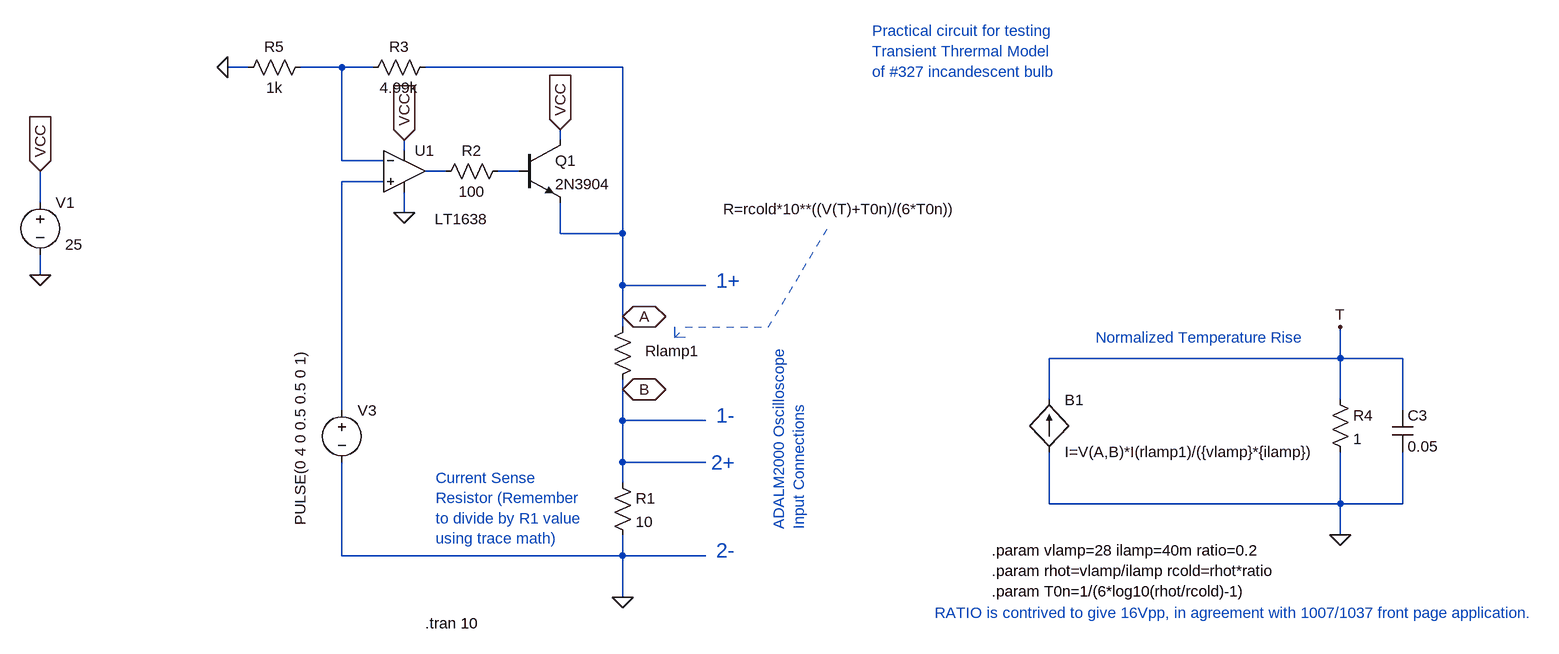
[diagram p0: schematic bulb_curve_tracer_circuit.asc]
bulb_curve_tracer_circuit.asc, the LTspice schematic file:
Version 4
SHEET 1 1952 844
WIRE -544 -304 -576 -304
WIRE -400 -304 -464 -304
WIRE -352 -304 -400 -304
WIRE 32 -304 -272 -304
WIRE -64 -192 -64 -208
WIRE -304 -176 -304 -192
WIRE -400 -160 -400 -304
WIRE -336 -160 -400 -160
WIRE -240 -144 -272 -144
WIRE -128 -144 -160 -144
WIRE -336 -128 -400 -128
WIRE -864 -96 -864 -144
WIRE -304 -80 -304 -112
WIRE -64 -48 -64 -96
WIRE 32 -48 32 -304
WIRE 32 -48 -64 -48
WIRE -864 16 -864 -16
WIRE 32 32 32 -48
WIRE 160 32 32 32
WIRE 32 80 32 32
WIRE 32 96 32 80
WIRE 1136 144 1136 96
WIRE 1136 144 688 144
WIRE 1232 144 1136 144
WIRE 32 192 32 176
WIRE 688 208 688 144
WIRE 1136 208 1136 144
WIRE -400 224 -400 -128
WIRE 1232 224 1232 144
WIRE 32 240 32 192
WIRE 160 240 32 240
WIRE 32 304 32 240
WIRE 160 304 32 304
WIRE 32 336 32 304
WIRE 688 368 688 288
WIRE 1136 368 1136 288
WIRE 1136 368 688 368
WIRE 1232 368 1232 288
WIRE 1232 368 1136 368
WIRE 1136 416 1136 368
WIRE -400 448 -400 304
WIRE 32 448 32 416
WIRE 32 448 -400 448
WIRE 160 448 32 448
WIRE 32 512 32 448
FLAG 32 512 0
FLAG 1136 96 T
FLAG 32 80 A
IOPIN 32 80 BiDir
FLAG 32 192 B
IOPIN 32 192 BiDir
FLAG 1136 416 0
FLAG -304 -80 0
FLAG -576 -304 0
FLAG -864 16 0
FLAG -864 -144 VCC
IOPIN -864 -144 In
FLAG -304 -192 VCC
IOPIN -304 -192 In
FLAG -64 -208 VCC
IOPIN -64 -208 In
SYMBOL bi2 688 208 R0
SYMATTR InstName B1
SYMATTR Value I=V(A,B)*I(rlamp1)/({vlamp}*{ilamp})
SYMBOL res 1120 192 R0
SYMATTR InstName R4
SYMATTR Value 1
SYMBOL cap 1216 224 R0
SYMATTR InstName C3
SYMATTR Value 0.05
SYMBOL res 48 80 M0
WINDOW 3 -139 -166 Right 2
WINDOW 0 -102 53 Left 2
SYMATTR Value R=rcold*10**((V(T)+T0n)/(6*T0n))
SYMATTR InstName Rlamp1
SYMBOL voltage -400 208 R0
WINDOW 3 -64 -77 VRight 2
WINDOW 123 0 0 Left 0
WINDOW 39 0 0 Left 0
SYMATTR Value PULSE(0 4 0 0.5 0.5 0 1)
SYMATTR InstName V3
SYMBOL res 16 320 R0
SYMATTR InstName R1
SYMATTR Value 10
SYMBOL OpAmps\\LT1638 -304 -208 R0
WINDOW 3 47 138 Left 2
SYMATTR InstName U1
SYMBOL npn -128 -192 R0
SYMATTR InstName Q1
SYMATTR Value 2N3904
SYMBOL voltage -864 -112 R0
WINDOW 3 38 81 Left 2
WINDOW 123 0 0 Left 0
WINDOW 39 0 0 Left 0
SYMATTR Value 25
SYMATTR InstName V1
SYMBOL res -144 -160 R90
WINDOW 0 0 56 VBottom 2
WINDOW 3 32 56 VTop 2
SYMATTR InstName R2
SYMATTR Value 100
SYMBOL res -256 -320 R90
WINDOW 0 0 56 VBottom 2
WINDOW 3 32 56 VTop 2
SYMATTR InstName R3
SYMATTR Value 4.99k
SYMBOL res -560 -288 R270
WINDOW 0 32 56 VTop 2
WINDOW 3 0 56 VBottom 2
SYMATTR InstName R5
SYMATTR Value 1k
TEXT -272 552 Left 2 !.tran 10
TEXT 600 440 Left 2 !.param vlamp=28 ilamp=40m ratio=0.2\n.param rhot=vlamp/ilamp rcold=rhot*ratio\n.param T0n=1/(6*log10(rhot/rcold)-1)
TEXT 512 536 Left 2 ;RATIO is contrived to give 16Vpp, in agreement with 1007/1037 front page application.
TEXT 760 112 Left 2 ;Normalized Temperature Rise
TEXT 272 408 VLeft 2 ;ADALM2000 Oscilloscope\nInput Connections
TEXT -256 328 Left 2 ;Current Sense\nResistor (Remember\nto divide by R1 value\nusing trace math)
TEXT 176 24 Left 3 ;1+
TEXT 176 232 Left 3 ;1-
TEXT 168 304 Left 3 ;2+
TEXT 176 440 Left 3 ;2-
TEXT 416 -360 Left 2 ;Practical circuit for testing\nTransient Thrermal Model\nof #327 incandescent bulb
LINE Normal 256 96 352 -64 2
LINE Normal 128 96 256 96 2
LINE Normal 112 112 128 96 2
LINE Normal 112 112 112 112 2
LINE Normal 112 112 112 112 2
LINE Normal 112 96 112 112 2
LINE Normal 112 112 112 96 2
LINE Normal 128 112 112 112 2

The netlist it stands for:
* bulb_curve_tracer_circuit.asc
B1 0 T I=V(A,B)*I(rlamp1)/({vlamp}*{ilamp})
R4 T 0 1
C3 T 0 0.05
Rlamp1 A B R=rcold*10**((V(T)+T0n)/(6*T0n))
V3 N004 0 PULSE(0 4 0 0.5 0.5 0 1)
R1 B 0 10
XU1 N004 N001 VCC 0 N002 LT1638  ; pins In+ In- V+ V- OUT
Q1 VCC N003 A 0 2N3904
V1 VCC 0 25
R2 N003 N002 100
R3 A N001 4.99k
R5 0 N001 1k
.model NPN NPN
.model PNP PNP
.lib standard.bjt
.tran 10
.param vlamp=28 ilamp=40m ratio=0.2
.param rhot=vlamp/ilamp rcold=rhot*ratio
.param T0n=1/(6*log10(rhot/rcold)-1)
* RATIO is contrived to give 16Vpp, in agreement with 1007/1037 front page application.
* Normalized Temperature Rise
* ADALM2000 Oscilloscope
* Input Connections
* Current Sense
* Resistor (Remember
* to divide by R1 value
* using trace math)
* 1+
* 1-
* 2+
* 2-
* Practical circuit for testing
* Transient Thrermal Model
* of #327 incandescent bulb
.backanno
.end